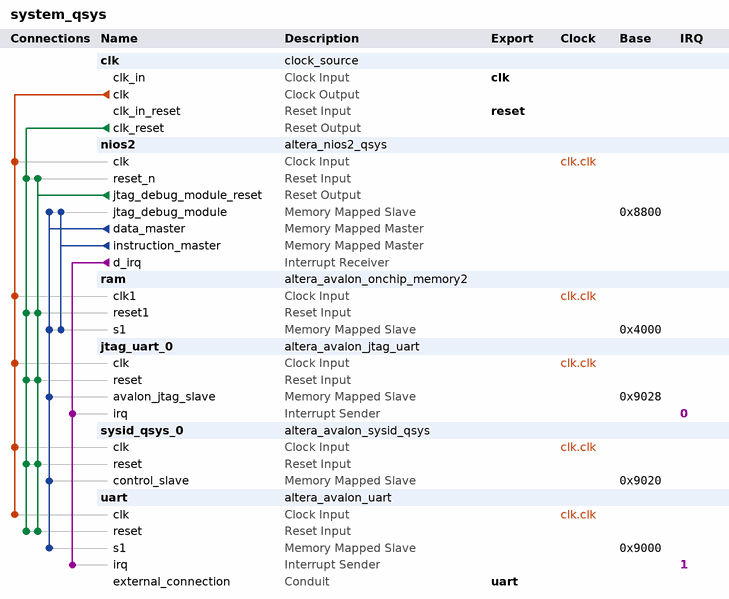
[diagram p0: system contents]
# Platform Designer (Qsys) system system_qsys, Cyclone IV E EP4CE115F29C7
# Parameters at their usual value, and those the tool derives, are not listed.
package require -exact qsys 13.1
create_system system_qsys
set_project_property DEVICE_FAMILY {Cyclone IV E}
set_project_property DEVICE EP4CE115F29C7

add_instance clk clock_source 13.1
set_instance_parameter_value clk clockFrequency 50000000

add_instance nios2 altera_nios2_qsys 13.1
set_instance_parameter_value nios2 resetSlave ram.s1
set_instance_parameter_value nios2 mmu_TLBMissExcSlave None
set_instance_parameter_value nios2 exceptionSlave ram.s1
set_instance_parameter_value nios2 breakSlave nios2.jtag_debug_module
set_instance_parameter_value nios2 impl Fast
set_instance_parameter_value nios2 icache_size 4096

add_instance ram altera_avalon_onchip_memory2 13.1
set_instance_parameter_value ram dataWidth 32
set_instance_parameter_value ram dualPort false
set_instance_parameter_value ram initMemContent true
set_instance_parameter_value ram initializationFileName onchip_mem.hex
set_instance_parameter_value ram memorySize 10240

add_instance jtag_uart_0 altera_avalon_jtag_uart 13.1
set_instance_parameter_value jtag_uart_0 simInteractiveOptions NO_INTERACTIVE_WINDOWS

add_instance sysid_qsys_0 altera_avalon_sysid_qsys 13.1
set_instance_parameter_value sysid_qsys_0 id 0

add_instance uart altera_avalon_uart 13.1
set_instance_parameter_value uart baud 115200
set_instance_parameter_value uart dataBits 8
set_instance_parameter_value uart fixedBaud true
set_instance_parameter_value uart parity NONE
set_instance_parameter_value uart stopBits 1

# connections
add_connection clk.clk jtag_uart_0.clk clock
add_connection clk.clk nios2.clk clock
add_connection clk.clk ram.clk1 clock
add_connection clk.clk sysid_qsys_0.clk clock
add_connection clk.clk uart.clk clock
add_connection clk.clk_reset jtag_uart_0.reset reset
add_connection clk.clk_reset nios2.reset_n reset
add_connection clk.clk_reset ram.reset1 reset
add_connection clk.clk_reset sysid_qsys_0.reset reset
add_connection clk.clk_reset uart.reset reset
add_connection nios2.jtag_debug_module_reset jtag_uart_0.reset reset
add_connection nios2.jtag_debug_module_reset nios2.reset_n reset
add_connection nios2.jtag_debug_module_reset ram.reset1 reset
add_connection nios2.jtag_debug_module_reset sysid_qsys_0.reset reset
add_connection nios2.jtag_debug_module_reset uart.reset reset
add_connection nios2.data_master jtag_uart_0.avalon_jtag_slave avalon
set_connection_parameter_value nios2.data_master/jtag_uart_0.avalon_jtag_slave baseAddress 0x9028
add_connection nios2.data_master nios2.jtag_debug_module avalon
set_connection_parameter_value nios2.data_master/nios2.jtag_debug_module baseAddress 0x8800
add_connection nios2.data_master ram.s1 avalon
set_connection_parameter_value nios2.data_master/ram.s1 baseAddress 0x4000
add_connection nios2.data_master sysid_qsys_0.control_slave avalon
set_connection_parameter_value nios2.data_master/sysid_qsys_0.control_slave baseAddress 0x9020
add_connection nios2.data_master uart.s1 avalon
set_connection_parameter_value nios2.data_master/uart.s1 baseAddress 0x9000
add_connection nios2.instruction_master nios2.jtag_debug_module avalon
set_connection_parameter_value nios2.instruction_master/nios2.jtag_debug_module baseAddress 0x8800
add_connection nios2.instruction_master ram.s1 avalon
set_connection_parameter_value nios2.instruction_master/ram.s1 baseAddress 0x4000
add_connection nios2.d_irq jtag_uart_0.irq interrupt
set_connection_parameter_value nios2.d_irq/jtag_uart_0.irq irqNumber 0
add_connection nios2.d_irq uart.irq interrupt
set_connection_parameter_value nios2.d_irq/uart.irq irqNumber 1

# exported interfaces
add_interface clk clock sink
set_interface_property clk EXPORT_OF clk.clk_in
add_interface reset reset sink
set_interface_property reset EXPORT_OF clk.clk_in_reset
add_interface uart conduit end
set_interface_property uart EXPORT_OF uart.external_connection

set_interconnect_requirement {$system} qsys_mm.clockCrossingAdapter HANDSHAKE
set_interconnect_requirement {$system} qsys_mm.maxAdditionalLatency 1
set_interconnect_requirement {$system} qsys_mm.insertDefaultSlave false

save_system system_qsys.qsys
